# EasyEDA schematic SCH_Flight-Computer-V4_2024-07-20.json
TITLE: Sheet_1; REV: 1.0; Date: 2024-07-19; Sheet: 1/1; Drawn By: usedgenes; Company: Your Company
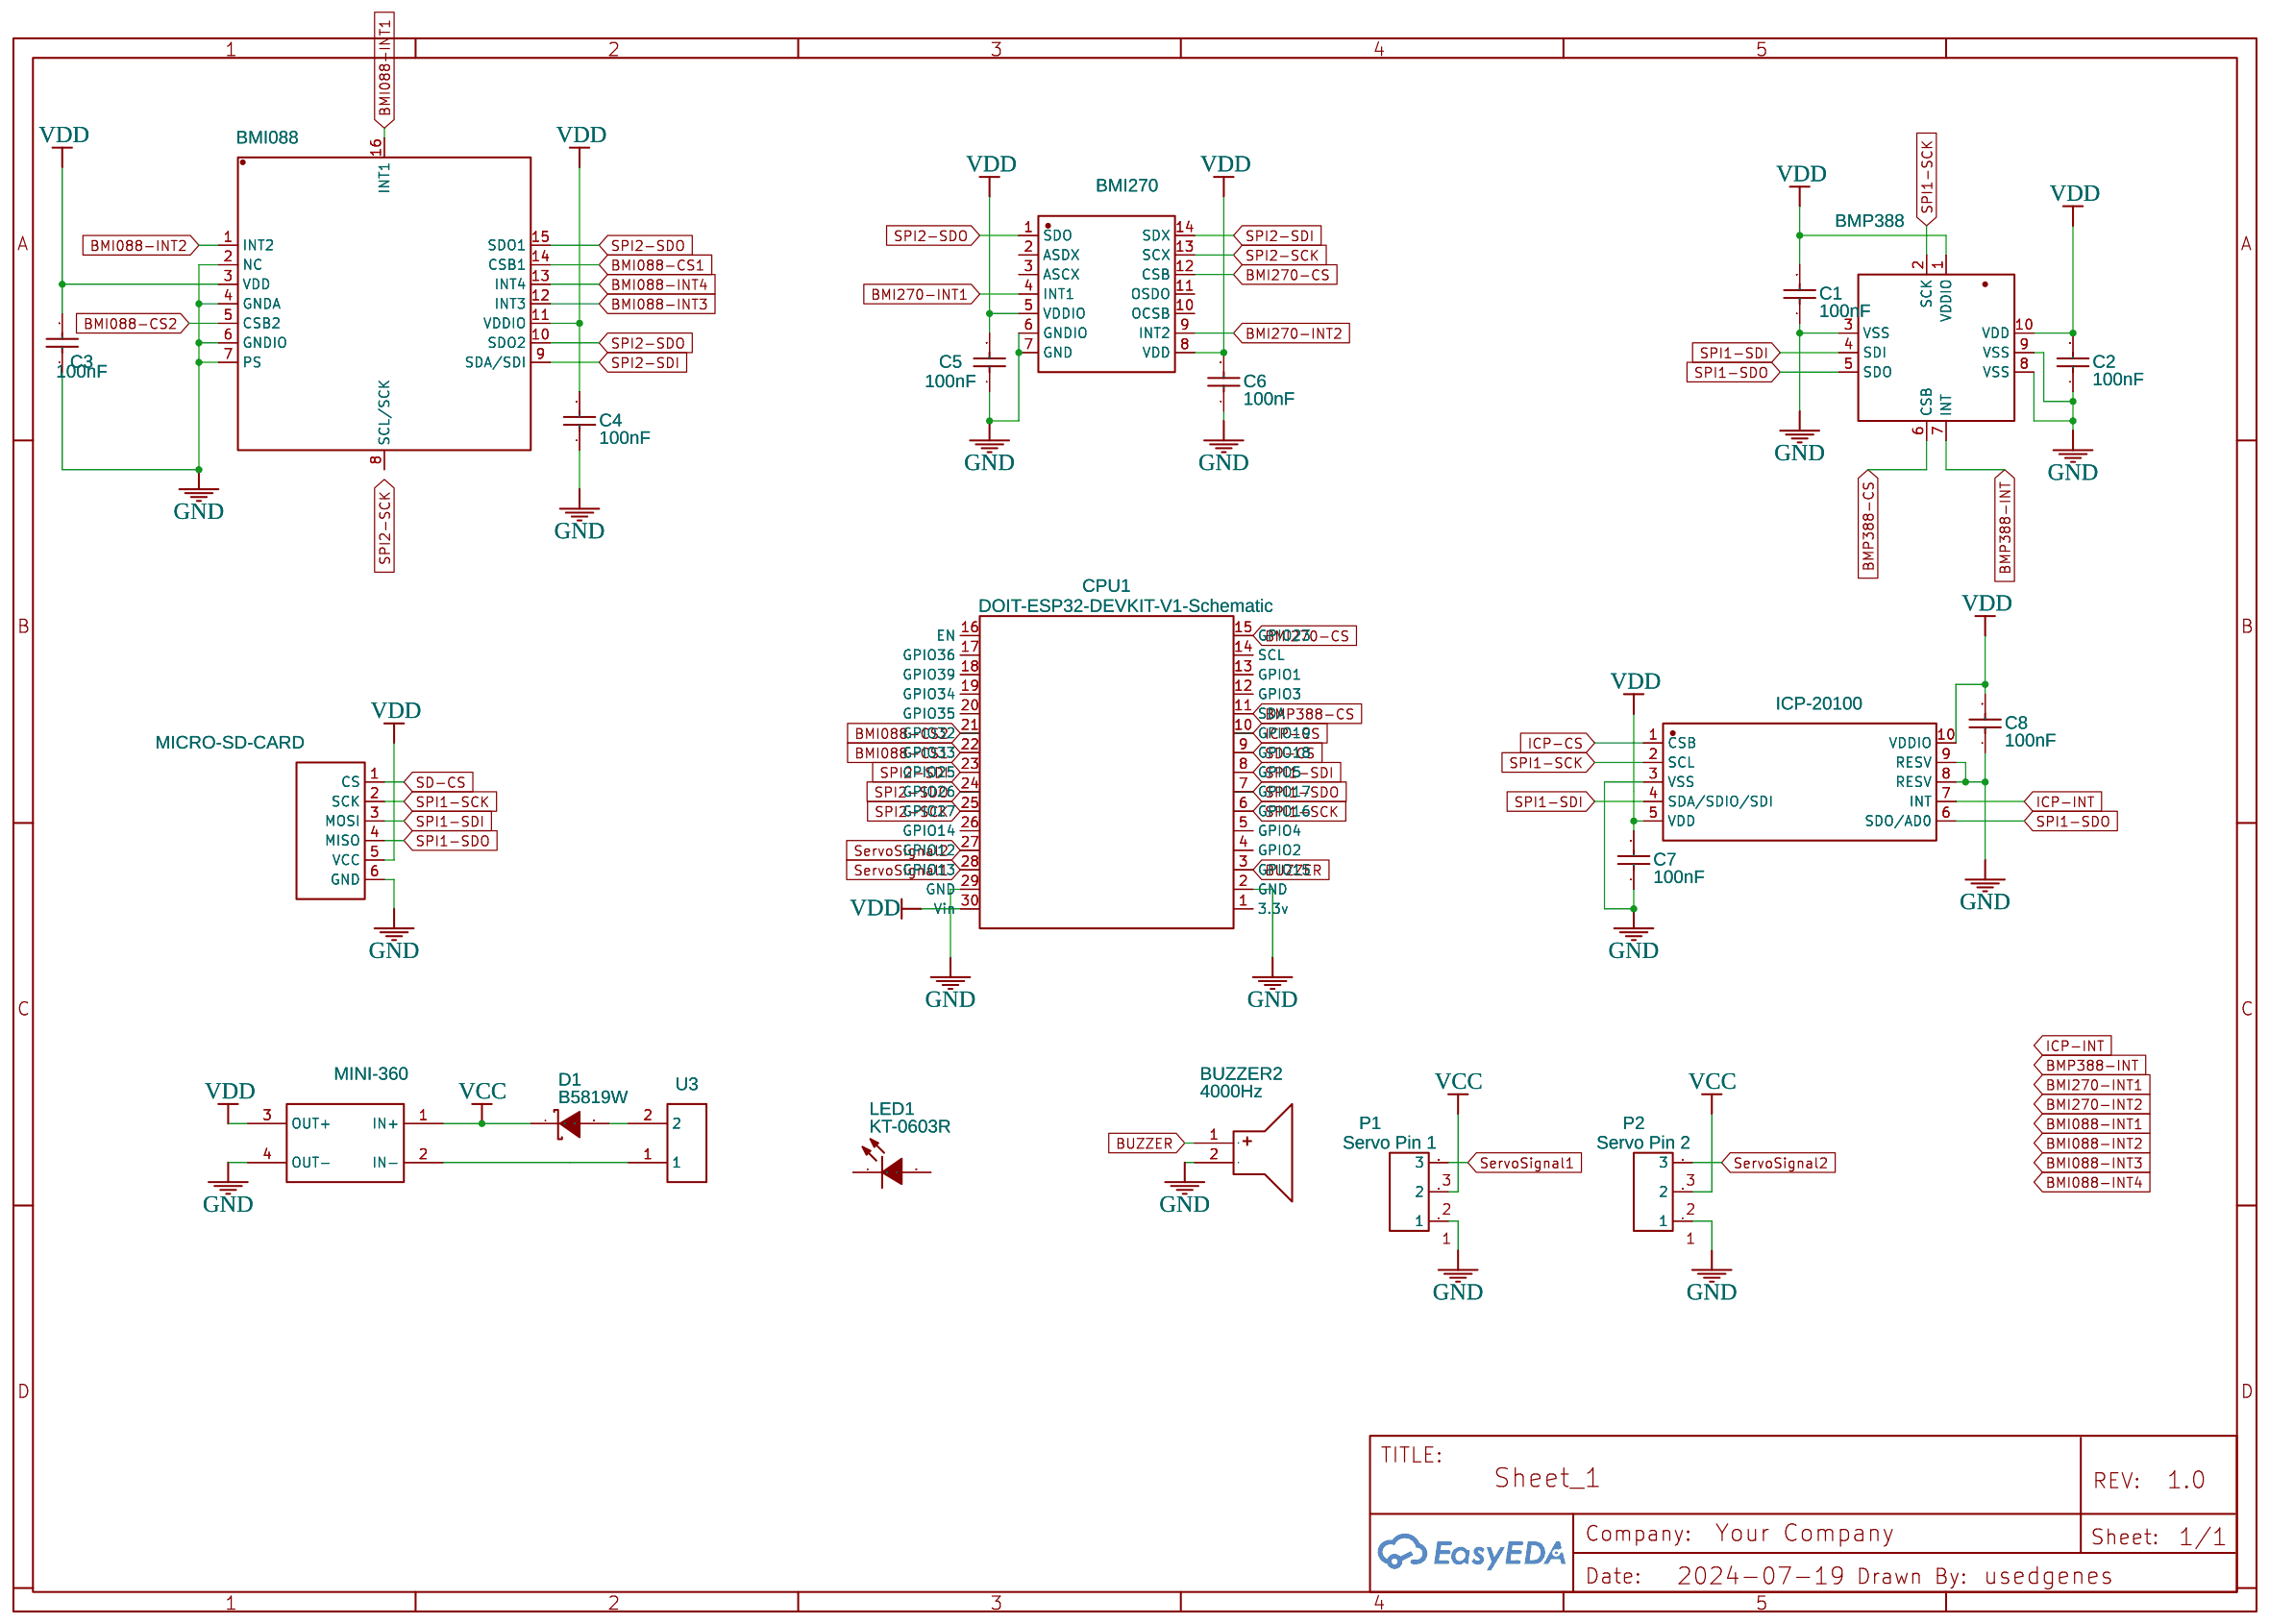
[diagram p0: schematic sheet]

## Parts
BMI088  BMI088  [LGA-16_L4.5-W3.0-P0.50-BL]
BMI270  BMI270  [LGA-14_L3.0-W2.5-P0.50-BR]
BMP388  BMP388  [SENSORM-SMD_BMP388]
BUZZER2  4000Hz  [BUZ-TH_BD14.0-P7.60-D1.0-L]
C1  100nF  [C0402]
C2  100nF  [C0402]
C3  100nF  [C0402]
C4  100nF  [C0402]
C5  100nF  [C0402]
C6  100nF  [C0402]
C7  100nF  [C0402]
C8  100nF  [C0402]
CPU1  DOIT-ESP32-DEVKIT-V1-Schematic  [DOIT-ESP32-DEVKIT-V1]
D1  B5819W  [SOD-123_L2.8-W1.8-LS3.7-RD]
ICP-20100  ICP-20100  [LGA-10_L2.0-W2.0-P0.50-TL_ICP-20100]
LED1  KT-0603R  [LED0603-RD]
MICRO-SD-CARD  MicroSDCardAdapter  [MICROSDCARDADAPTER]
MINI-360  MINI-360  [DSN-MINI-360]
P1  Servo Pin 1  [CONNECTOR_PINHEADER_2.54MM:PINHEADER_1X3]
P2  Servo Pin 2  [CONNECTOR_PINHEADER_2.54MM:PINHEADER_1X3]
U3  Power Pins  [PIN HEADER CONNECTOR 1X2 PINS_PITCH 2.54MM]

## Library data of the parts
BMI088 = BMI088: Contributor: LCSC; Supplier: LCSC; Supplier Part: C194919; Manufacturer: Bosch(博世); JLCPCB Part Class: Extended Part
BMI270 = BMI270: Contributor: LCSC; Supplier: LCSC; Supplier Part: C2836813; Manufacturer: Bosch(博世); JLCPCB Part Class: Extended Part
BMP388 = BMP388: Contributor: LCSC; Supplier: LCSC; Supplier Part: C779278; Manufacturer: Bosch(博世); JLCPCB Part Class: Extended Part
BUZZER2 = SKY-1475-0540-45P7.6: Contributor: LCSC; Supplier: LCSC; Supplier Part: C511707; Manufacturer: S&S(海旭); JLCPCB Part Class: Extended Part
C1-C8 = CL05B104KO5NNNC: Supplier: LCSC; Manufacturer: SAMSUNG(三星); Supplier Part: C1525; JLCPCB Part Class: Basic Part
CPU1 = DOIT-ESP32-DEVKIT-V1-Schematic: Manufacturer: NONE; Manufacturer Part: NONE; Supplier Part: NONE; link: NONE; Contributor: KaScada
D1 = B5819W: Supplier: LCSC; Manufacturer: MDD(辰达半导体); Supplier Part: C64885; JLCPCB Part Class: Extended Part
ICP-20100 = ICP-20100: Supplier: LCSC; Supplier Part: C5343527; Manufacturer: TDK; JLCPCB Part Class: Extended Part; Contributor: lcsc
LED1 = KT-0603R: Supplier: LCSC; Manufacturer: KENTO; Supplier Part: C2286; JLCPCB Part Class: Basic Part
MICRO-SD-CARD = MicroSDCardAdapter: Contributor: dalewski; Package Display: No
MINI-360 = MINI-360: Contributor: RaspAutomacao
P1 P2 = HEADER PAD 3X RMM COPY: Supplier: LCSC; Manufacturer: BOOMELE; Manufacturer Part: Female headerHDR1X8-2.54; Supplier Part: C27438; JLCPCB Part Class: Extended Part; Contributor: blackhassio; Package Display: No
U3 = 1X2: Contributor: Ramsha

## Nets
GND: BMI088.2(NC) BMI088.4(GNDA) BMI088.6(GNDIO) BMI088.7(PS) BMI270.6(GNDIO) BMI270.7(GND) BMP388.3(VSS) BMP388.8(VSS) BMP388.9(VSS) BUZZER2.2(-) C1.1 C2.1 C3.1 C4.1 C5.1 C6.1 C7.1 C8.1 CPU1.2(GND) CPU1.29(GND) ICP-20100.3(VSS) ICP-20100.8(RESV) ICP-20100.9(RESV) MICRO-SD-CARD.6(GND) MINI-360.4(OUT-) P1.1 P2.1
VCC: D1.1(K) MINI-360.1(IN+) P1.2 P2.2
VDD: BMI088.3(VDD) BMI088.11(VDDIO) BMI270.5(VDDIO) BMI270.8(VDD) BMP388.1(VDDIO) BMP388.10(VDD) C1.2 C2.2 C3.2 C4.2 C5.2 C6.2 C7.2 C8.2 CPU1.30(Vin) ICP-20100.5(VDD) ICP-20100.10(VDDIO) MICRO-SD-CARD.5(VCC) MINI-360.3(OUT+)
BMI088-CS1: BMI088.14(CSB1) CPU1.22(GPIO33)
BMI088-CS2: BMI088.5(CSB2) CPU1.21(GPIO32)
BMI088-INT1: BMI088.16(INT1)
BMI088-INT2: BMI088.1(INT2)
BMI088-INT3: BMI088.12(INT3)
BMI088-INT4: BMI088.13(INT4)
BMI270-CS: BMI270.12(CSB) CPU1.15(GPIO23)
BMI270-INT1: BMI270.4(INT1)
BMI270-INT2: BMI270.9(INT2)
BMP388-CS: BMP388.6(CSB) CPU1.11(SDA)
BMP388-INT: BMP388.7(INT)
BUZZER: BUZZER2.1(+) CPU1.3(GPIO15)
ICP-CS: CPU1.10(GPIO19) ICP-20100.1(CSB)
ICP-INT: ICP-20100.7(INT)
SD-CS: CPU1.9(GPIO18) MICRO-SD-CARD.1(CS)
ServoSignal1: CPU1.28(GPIO13) P1.3
ServoSignal2: CPU1.27(GPIO12) P2.3
SPI1-SCK: BMP388.2(SCK) CPU1.6(GPIO16) ICP-20100.2(SCL) MICRO-SD-CARD.2(SCK)
SPI1-SDI: BMP388.4(SDI) CPU1.8(GPIO5) ICP-20100.4(SDA/SDIO/SDI) MICRO-SD-CARD.3(MOSI)
SPI1-SDO: BMP388.5(SDO) CPU1.7(GPIO17) ICP-20100.6(SDO/AD0) MICRO-SD-CARD.4(MISO)
SPI2-SCK: BMI270.13(SCX) CPU1.25(GPIO27)
SPI2-SDI: BMI088.9(SDA/SDI) BMI270.14(SDX) CPU1.23(GPIO25)
SPI2-SDO: BMI088.10(SDO2) BMI088.15(SDO1) BMI270.1(SDO) CPU1.24(GPIO26)
Net-(D1-2): D1.2(A) U3.2
Net-(MINI-360-2): MINI-360.2(IN-) U3.1

Not connected (* = marked no-connect by the designer): BMI088 8(SCL/SCK); BMI270 2(ASDX) 3(ASCX) 10(OCSB) 11(OSDO); CPU1 1(3.3v) 4(GPIO2) 5(GPIO4) 12(GPIO3) 13(GPIO1) 14(SCL) 16(EN) 17(GPIO36) 18(GPIO39) 19(GPIO34) 20(GPIO35) 26(GPIO14); LED1 1(K) 2(A)
